# EAGLE design ADC (EAGLE 7.6.0)
AUTHOR: Frantisek Burian; DOCNO: KAMBOT002; PROJECT_DESC: Deska A/D prevodniku na I2C; PROJECT_NAME: KAMBot; REVISION: B
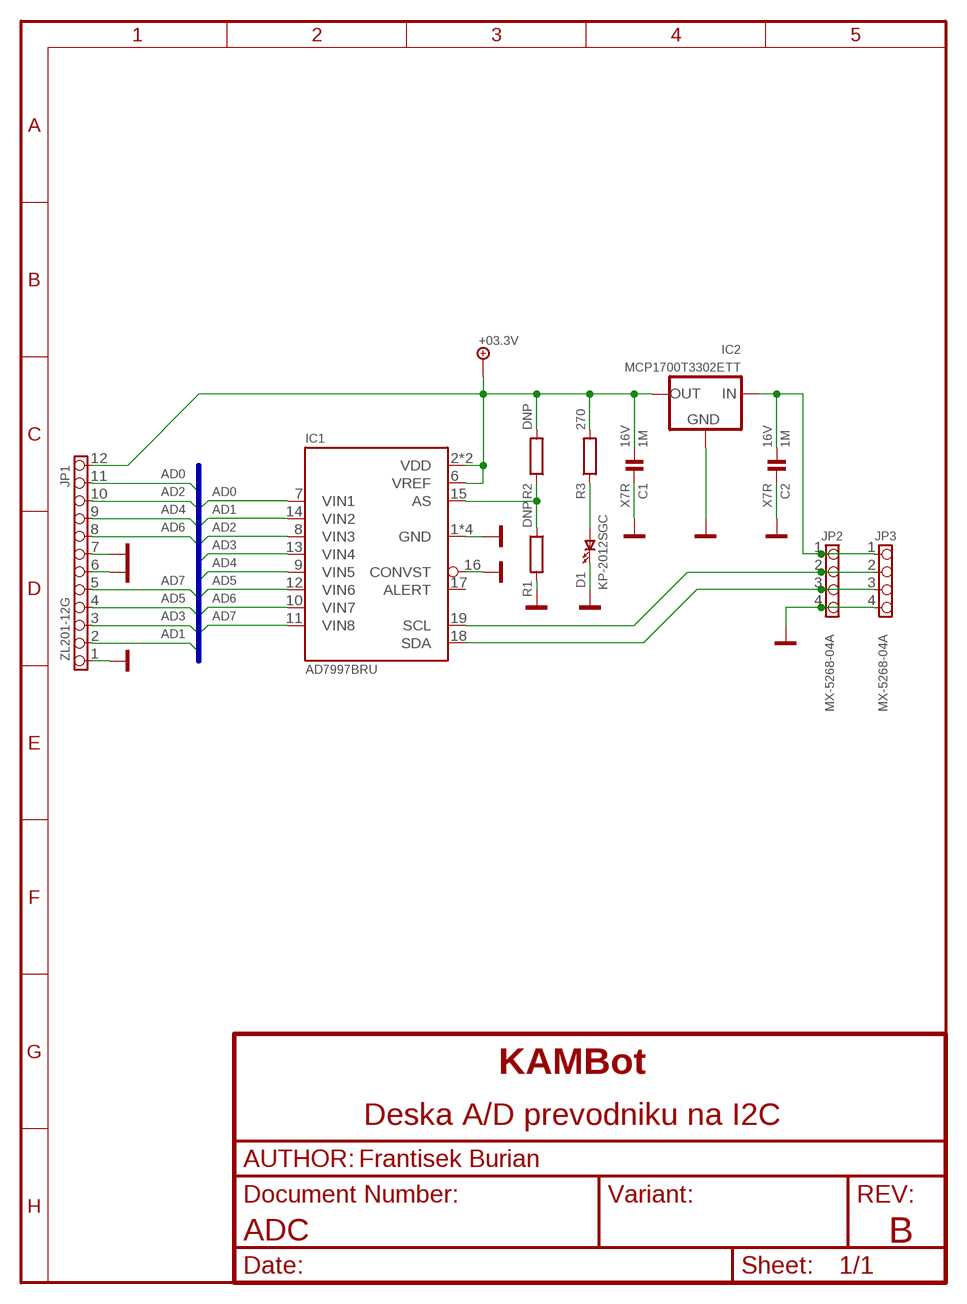
[diagram p0: schematic, sheet 1]

## Parts
C1  1M  C0805  [0805]
C2  1M  C0805  [0805]
D1  KP-2012SGC  LED0805  [LED_0805]
IC1  AD7997BRU  [TSSOP20]
IC2  MCP1700T3302ETT  MCP1700  [SOT23]
JP1  ZL201-12G  PINHD-1X12_254_EDGE  [1X12_254_EDGE]
JP2  MX-5268-04A  PINHD-1X4_250_MX5268  [1X04_250_MX5268]
JP3  MX-5268-04A  PINHD-1X4_250_MX5268  [1X04_250_MX5268]
R1  DNP  R_R0805  [0805]
R2  DNP  R_R0805  [0805]
R3  270  R_R0805  [0805]

## Nets
+3.3V: C1.2 IC1.2(VDD) IC1.5(VDD) IC1.6(VREF) IC2.2(OUT) JP1.12 R2.2 R3.2 ; supply symbol labelled +03.3V
AD0: IC1.7(VIN1) JP1.11
AD1: IC1.14(VIN2) JP1.2
AD2: IC1.8(VIN3) JP1.10
AD3: IC1.13(VIN4) JP1.3
AD4: IC1.9(VIN5) JP1.9
AD5: IC1.12(VIN6) JP1.4
AD6: IC1.10(VIN7) JP1.8
AD7: IC1.11(VIN8) JP1.5
GND: C1.1 C2.1 D1.K(C) IC1.1(GND) IC1.3(GND) IC1.4(GND) IC1.16(CONVST) IC1.20(GND) IC2.1(GND) JP1.1 JP1.6 JP1.7 JP2.4 JP3.4 R1.2
N$2: C2.2 IC2.3(IN) JP2.1 JP3.1
N$3: IC1.19(SCL) JP2.2 JP3.2
N$4: IC1.18(SDA) JP2.3 JP3.3
N$5: D1.A R3.1
N$6: IC1.15(AS) R1.1 R2.1
Unconnected: IC1.17(ALERT)

## Buses
AD[0..7]

## Library data of the parts
C1 C2 = !discrete:C: Kondenzator; MATERIAL: X7R; PRICE: 0.27; URL: http://www.tme.eu/cz/details/cl21b105kofnnng/kondenzatory-mlcc-smd-0805/samsung/; VOLTAGE: 16V
D1 = !opto:LED: Dioda LED; PRICE: 1.00; URL: http://www.tme.eu/cz/details/kp-2012sgc/diody-led-smd-barevne/kingbright-electronic/
IC1 = !ic_analogdevices:AD7997: IO - A/D Konvertor; PRICE: 69.00; URL: https://www.gme.cz/ad7997bruz-0-tssop20-analog-devices
IC2 = !stab:MCP1700: IO - Stabilizator; PRICE: 8.78; URL: http://www.tme.eu/cz/details/mcp1700t3302ett/stabilizatory-napeti-neregulovane-ldo/microchip-technology/mcp1700t-3302ett/
JP1 = !pinhead:PINHD-1X12: Konektor 12 PIN Typ Rastr Imax Umax Rmax Kontakt 2.54 mm 500 mA 125 V 50 mOhm krimp /90 2.54 mm 500 mA 125 V 50 mOhm krimp _MX5267 2.50 mm 2.5 A 250 V 20 mOhm krimp _MX53048 1.25 mm 800 mA 125 V 20 mOhm krimp _PV-3.81 3.81 mm 8 A 130 V 30 mOhm ?roub; PRICE: 2.80; URL: http://www.tme.eu/cz/details/zl201-14g/konektory-hrebinky/connfly/ds1021-1_14sf11/
JP2 JP3 = !pinhead:PINHD-1X4: Konektor 4 PIN Typ Rastr Imax Umax Rmax Kontakt 2.54 mm 500 mA 125 V 50 mOhm krimp /90 2.54 mm 500 mA 125 V 50 mOhm krimp _MX5267 2.50 mm 2.5 A 250 V 20 mOhm krimp _MX53048 1.25 mm 800 mA 125 V 20 mOhm krimp _PV-3.81 3.81 mm 8 A 130 V 30 mOhm ?roub; PRICE: 2.52; URL: http://www.tme.eu/cz/details/mx-5268-04a/signalove-konektory-raster-250mm/molex/022057045-22-05-7045-5268-04a/
R1 R2 = !discrete:R_: Rezistor
R3 = !discrete:R_: Rezistor; PRICE: 0.15; URL: http://www.tme.eu/cz/details/rc0805jr-07270r/rezistory-smd-0805/yageo/rc0805jr-07270rl/

## Board
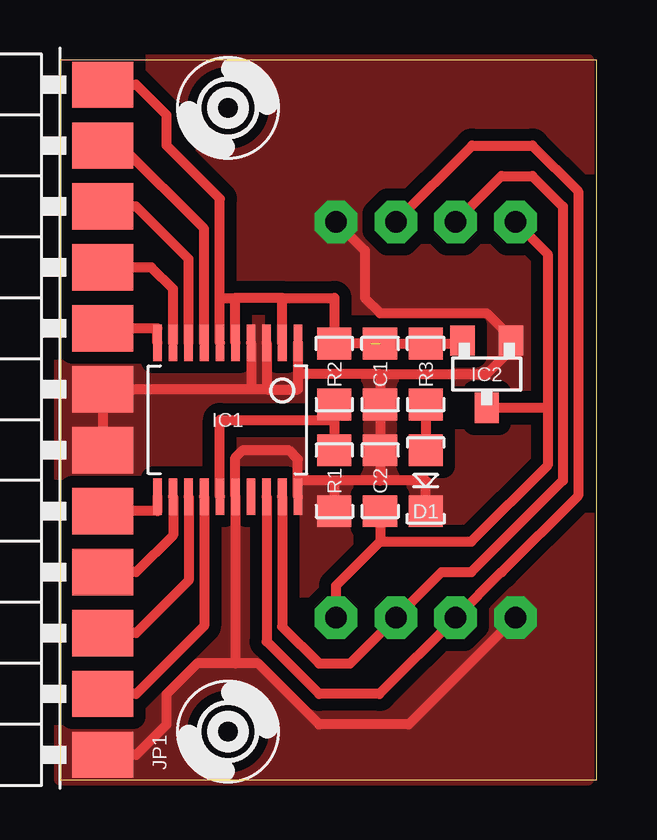
[diagram p1: board, top side]
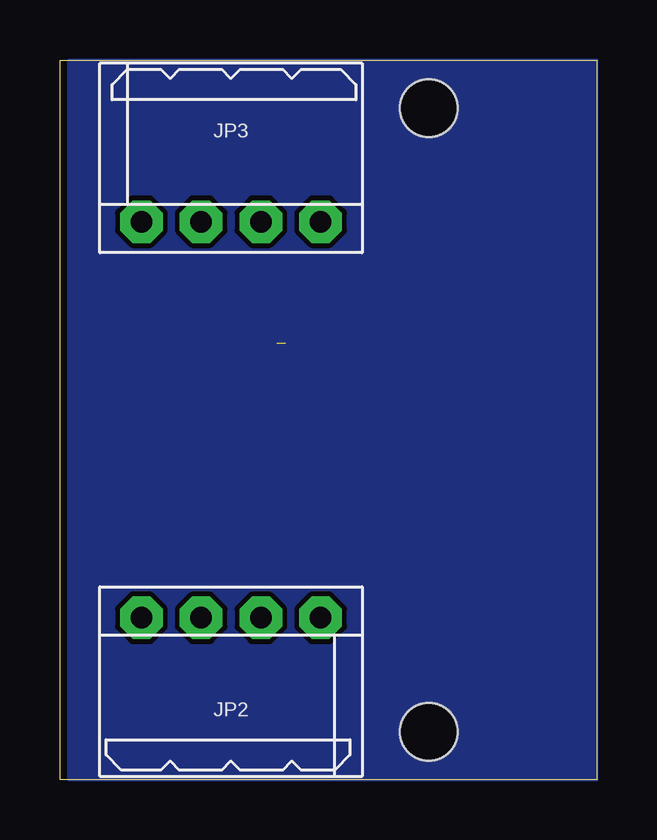
[diagram p2: board, bottom side, seen from below]

Size 22.36 x 30 mm. Coordinates in mm from the lower left corner, seen from the top.
Outline: 0,0 22.36,0 22.36,30 0,30 0,0
Copper layers (1*16): Top 0.035mm / dielectric 1.5mm / Bottom 0.035mm
Design rules "default *": minimum track width 10mil, minimum drill 24mil, track to track 8mil, track to pad 8mil, pad to pad 8mil, via to via 8mil, smd to smd 8mil, copper to edge 0mil, drill to drill 8mil, minimum pad ring 10mil, minimum via ring 8mil, stop-mask expansion 4mil, vias tented up to drill 0mil, thermal gap 10mil

### Footprints (pad centres in the part's own frame; a part is rotated, then mirrored left to right if it is on the bottom)
0805 = smd 1.321 x 1.422: 1 -1.27,0; 2 1.27,0
LED_0805 = smd 1.321 x 1.422: A -1.27,0; K 1.27,0
2,4 = hole 2.4: 0,0
TSSOP20 = smd 0.356 x 1.524: 1 -2.925,-3.2; 2 -2.275,-3.2; 3 -1.625,-3.2; 4 -0.975,-3.2; 5 -0.325,-3.2; 6 0.325,-3.2; 7 0.975,-3.2; 8 1.625,-3.2; 9 2.275,-3.2; 10 2.925,-3.2; 11 2.925,3.2; 12 2.275,3.2; 13 1.625,3.2; 14 0.975,3.2; 15 0.325,3.2; 16 -0.325,3.2; 17 -0.975,3.2; 18 -1.625,3.2; 19 -2.275,3.2; 20 -2.925,3.2
SOT23 = smd 1.016 x 1.27: 1 -1.016,-1.397; 2 1.016,-1.397; 3 0,1.397
1X12_254_EDGE = smd 1.93 x 2.54: 1 -12.7,-1.778; 2 -10.16,-1.778; 3 -7.62,-1.778; 4 -5.08,-1.778; 5 -2.54,-1.778; 6 0,-1.778; 7 2.54,-1.778; 8 5.08,-1.778; 9 7.62,-1.778; 10 10.16,-1.778; 11 12.7,-1.778; 12 15.24,-1.778
1X04_250_MX5268 = drill 0.9 pad 1.778 octagon: 1 3.734,0; 2 1.245,0; 3 -1.245,0; 4 -3.734,0

### Placement (x,y rotation side)
C1  13.34,16.91 90 top
C2  13.34,12.46 270 top
D1  15.24,12.46 270 top
H1  [2,4]  7,28 0 top
H2  [2,4]  7,2 0 top
IC1  6.99,15 180 top
IC2  17.78,16.91 180 top
JP1  0,13.73 90 top
JP2  15.24,6.74 0 bottom
JP3  15.24,23.26 180 bottom
R1  11.43,12.46 270 top
R2  11.43,16.91 90 top
R3  15.24,16.91 90 top
U$2  [DIN_A4_SCALE4]  -12.7,-28.18 0 top  (outside the outline)
U$3  [DIN_DOCFIELD_SCALE4]  6.99,-28.18 0 top  (outside the outline)

### Tracks (layer width: path | path; a pad name or v marks a point on that pad's centre or on a via)
+3.3V  (1 unrouted)
  Top 0.406: IC1.6 6.66,20.08 | 6.66,20.08 7.31,20.08 | IC1.5 7.31,20.08 | JP1.12 3.17,28.97 4.45,27.7 4.45,26.43 6.66,24.21 6.66,20.08 | IC1.2 9.26,20.08 | 9.26,20.08 7.31,20.08 | 9.26,20.08 11.43,20.08 R2.2 12.95,18.18 | C1.2 R3.2 16.64,18.18 IC2.2
AD0
  Top 0.406: IC1.7 6.01,22.96 2.54,26.43 JP1.11
AD1
  Top 0.406: JP1.2 3.17,3.57 6.01,6.4 IC1.14
AD2
  Top 0.406: IC1.8 5.36,21.7 3.17,23.89 JP1.10
AD3
  Top 0.406: IC1.13 5.36,8.29 3.17,6.11 JP1.3
AD4
  Top 0.406: IC1.9 4.71,20.45 3.81,21.35 JP1.9
AD5
  Top 0.406: IC1.12 4.71,10.18 3.17,8.65 JP1.4
AD6
  Top 0.406: IC1.10 4.06,18.81 JP1.8
AD7
  Top 0.406: IC1.11 4.06,11.19 JP1.5
GND
  Top 0.406: IC1.4 7.96,16.27 | IC1.3 8.61,16.27 | 8.61,16.27 7.96,16.27 | JP1.1 3.17,1.03 4.45,2.3 4.45,3.57 5.71,4.84 7.31,4.84 | JP1.6 JP1.7 7.96,16.27 | 8.61,16.27 9.91,16.27 9.91,16.91 | 13.34,16.91 17.78,16.91 18.8,17.92 IC2.1 18.8,18.43 17.78,19.45 13.34,19.45 12.7,20.08 12.7,22.06 JP3.4 | IC1.1 9.91,16.91 | IC1.20 9.91,12.46 | 9.91,12.46 9.91,13.35 9.53,13.73 7.62,13.73 7.31,13.42 IC1.16 7.31,4.84 | JP2.4 14.53,2.3 10.79,2.3 8.26,4.84 7.31,4.84 | 13.34,16.91 C1.1 C2.1 13.34,12.46 | 13.34,16.91 9.91,16.91 | 11.43,12.46 R1.2 | D1.K 15.24,12.46 13.34,12.46 | 13.34,12.46 11.43,12.46 | 11.43,12.46 9.91,12.46
  pour Top (isolate 0.508, no thermals): 0,30 22,30 22,0 0,0
N$1
  pour Bottom (no thermals): 0,30 22,30 22,0 0,0
N$2
  Top 0.406: JP2.1 11.51,8.09 13.34,9.92 | C2.2 13.34,9.92 | 13.34,9.92 17.14,9.92 20.32,13.1 20.32,15.51 | JP3.1 20.32,21.91 20.32,15.51 | IC2.3 20.32,15.51
N$3
  Top 0.406: IC1.19 9.26,6.38 10.79,4.84 12.09,4.84 JP2.2 15.9,8.65 17.14,8.65 20.95,12.46 20.95,23.89 19.68,25.16 18.39,25.16 JP3.2
N$4
  Top 0.406: IC1.18 8.61,5.76 10.79,3.57 13.31,3.57 JP2.3 18.41,8.68 18.41,8.65 21.59,11.82 21.59,24.52 19.68,26.43 17.17,26.43 JP3.3
N$5
  Top 0.406: R3.1 D1.A
N$6
  Top 0.406: IC1.15 6.66,15 11.43,15 | R2.1 11.43,15 | 11.43,15 R1.1

### Text on the board
bRestrict: +3V | AD0 | AD2 | AD4 | AD6 | GND | GND | AD7 | AD5 | AD3 | AD1 | GND